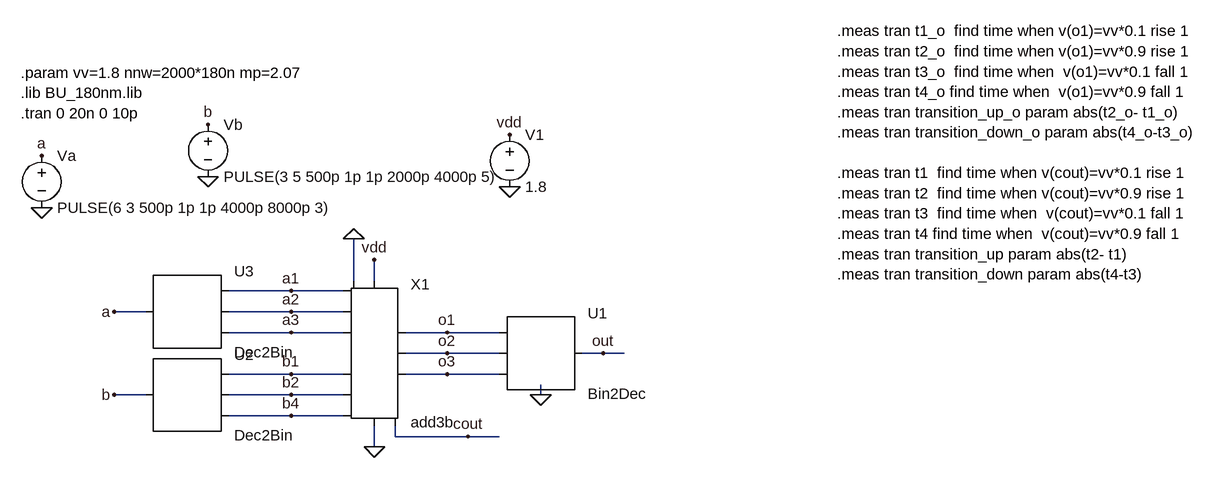
[diagram p0: schematic add_test_trans.asc]
add_test_trans.asc, the LTspice schematic file:
Version 4
SHEET 1 1732 680
WIRE 368 128 368 64
WIRE 400 128 400 96
WIRE 272 144 176 144
WIRE 352 144 272 144
WIRE 48 176 0 176
WIRE 272 176 176 176
WIRE 352 176 272 176
WIRE 272 208 176 208
WIRE 352 208 272 208
WIRE 512 208 448 208
WIRE 592 208 512 208
WIRE 512 240 448 240
WIRE 592 240 512 240
WIRE 752 240 720 240
WIRE 784 240 752 240
WIRE 272 272 176 272
WIRE 352 272 272 272
WIRE 512 272 448 272
WIRE 592 272 512 272
WIRE 48 304 0 304
WIRE 272 304 176 304
WIRE 352 304 272 304
WIRE 656 304 656 288
WIRE 272 336 176 336
WIRE 352 336 272 336
WIRE 432 368 432 352
WIRE 544 368 432 368
WIRE 592 368 544 368
WIRE 400 384 400 352
FLAG 752 240 out
FLAG 400 96 vdd
FLAG 400 384 0
FLAG 608 -16 0
FLAG -112 16 0
FLAG 144 -32 0
FLAG 608 -96 vdd
FLAG -112 -64 a
FLAG 144 -112 b
FLAG 0 176 a
FLAG 0 304 b
FLAG 544 368 cout
FLAG 512 208 o1
FLAG 512 240 o2
FLAG 512 272 o3
FLAG 272 144 a1
FLAG 272 176 a2
FLAG 272 208 a3
FLAG 272 272 b1
FLAG 272 304 b2
FLAG 272 336 b4
FLAG 656 304 0
FLAG 368 64 0
SYMBOL Bin2Dec 656 240 R0
SYMATTR InstName U1
SYMATTR SpiceLine Vhigh={vv}
SYMBOL Dec2Bin 112 304 R0
SYMATTR InstName U2
SYMATTR SpiceLine Vhigh={vv}
SYMBOL Dec2Bin 112 176 R0
SYMATTR InstName U3
SYMATTR SpiceLine Vhigh={vv}
SYMBOL /voltage 608 -112 R0
SYMATTR InstName V1
SYMATTR Value 1.8
SYMBOL /voltage -112 -80 R0
SYMATTR InstName Va
SYMATTR Value PULSE(6 3 500p 1p 1p 4000p 8000p 3)
SYMBOL /voltage 144 -128 R0
SYMATTR InstName Vb
SYMATTR Value PULSE(3 5 500p 1p 1p 2000p 4000p 5)
SYMBOL add3b 400 240 R0
SYMATTR InstName X1
TEXT -144 -192 Left 2 !.param vv=1.8 nnw=2000*180n mp=2.07\n.lib BU_180nm.lib\n.tran 0 20n 0 10p
TEXT 1112 -256 Left 2 !.meas tran t1_o  find time when v(o1)=vv*0.1 rise 1\n.meas tran t2_o  find time when v(o1)=vv*0.9 rise 1\n.meas tran t3_o  find time when  v(o1)=vv*0.1 fall 1\n.meas tran t4_o find time when  v(o1)=vv*0.9 fall 1\n.meas tran transition_up_o param abs(t2_o- t1_o)\n.meas tran transition_down_o param abs(t4_o-t3_o)\n \n.meas tran t1  find time when v(cout)=vv*0.1 rise 1\n.meas tran t2  find time when v(cout)=vv*0.9 rise 1\n.meas tran t3  find time when  v(cout)=vv*0.1 fall 1\n.meas tran t4 find time when  v(cout)=vv*0.9 fall 1\n.meas tran transition_up param abs(t2- t1)\n.meas tran transition_down param abs(t4-t3)

The netlist it stands for:
* add_test_trans.asc
XU1 o1 o2 o3 out Bin2Dec Vhigh={vv}
XU2 b b1 b2 b4 Dec2Bin Vhigh={vv}
XU3 a a1 a2 a3 Dec2Bin Vhigh={vv}
V1 vdd 0 1.8
Va a 0 PULSE(6 3 500p 1p 1p 4000p 8000p 3)
Vb b 0 PULSE(3 5 500p 1p 1p 2000p 4000p 5)
XX1 vdd a1 a2 a3 b1 b2 b4 0 o1 o2 o3 cout 0 add3b
.param vv=1.8 nnw=2000*180n mp=2.07
.lib BU_180nm.lib
.tran 0 20n 0 10p
.meas tran t1_o  find time when v(o1)=vv*0.1 rise 1
.meas tran t2_o  find time when v(o1)=vv*0.9 rise 1
.meas tran t3_o  find time when  v(o1)=vv*0.1 fall 1
.meas tran t4_o find time when  v(o1)=vv*0.9 fall 1
.meas tran transition_up_o param abs(t2_o- t1_o)
.meas tran transition_down_o param abs(t4_o-t3_o)
.meas tran t1  find time when v(cout)=vv*0.1 rise 1
.meas tran t2  find time when v(cout)=vv*0.9 rise 1
.meas tran t3  find time when  v(cout)=vv*0.1 fall 1
.meas tran t4 find time when  v(cout)=vv*0.9 fall 1
.meas tran transition_up param abs(t2- t1)
.meas tran transition_down param abs(t4-t3)
.lib BIN2DEC.sub
.lib DEC2BIN.sub
.backanno
.end